# EAGLE schematic Audio-DAC (EAGLE 9.6.2)

## Sheet 1 of 2
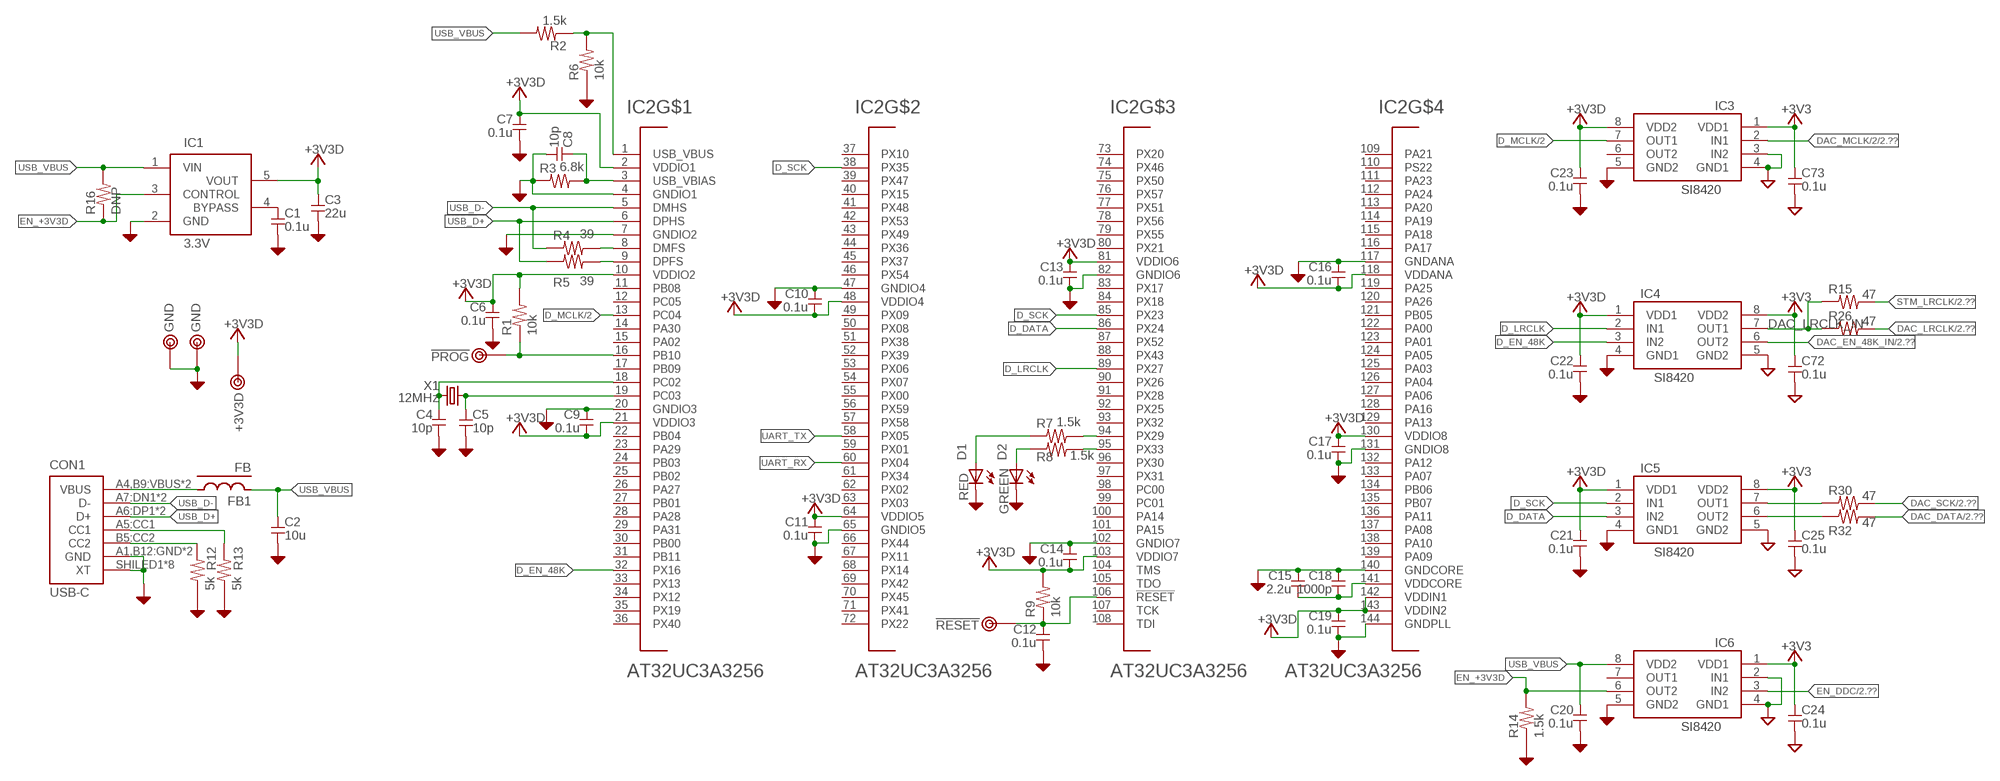
[diagram p0: schematic, sheet 1]

### Parts
C1  0.1u  C-1608  [1608C]
C2  10u  C-2012  [2012]
C3  22u  C-2012  [2012]
C4  10p  C-1608  [1608C]
C5  10p  C-1608  [1608C]
C6  0.1u  C-1608  [1608C]
C7  0.1u  C-1608  [1608C]
C8  10p  C-1608  [1608C]
C9  0.1u  C-1608  [1608C]
C10  0.1u  C-1608  [1608C]
C11  0.1u  C-1608  [1608C]
C12  0.1u  C-1608  [1608C]
C13  0.1u  C-1608  [1608C]
C14  0.1u  C-1608  [1608C]
C15  2.2u  C-2012  [2012]
C16  0.1u  C-1608  [1608C]
C17  0.1u  C-1608  [1608C]
C18  1000p  C-1608  [1608C]
C19  0.1u  C-1608  [1608C]
C20  0.1u  C-1608  [1608C]
C21  0.1u  C-1608  [1608C]
C22  0.1u  C-1608  [1608C]
C23  0.1u  C-1608  [1608C]
C24  0.1u  C-1608  [1608C]
C25  0.1u  C-1608  [1608C]
C72  0.1u  C-1608  [1608C]
C73  0.1u  C-1608  [1608C]
CON1  USB-C  [5077CR-16-SMC2-BK-TR]
D1  RED  LED-SMD1608  [D1608]
D2  GREEN  LED-SMD1608  [D1608]
FB1  FB  [1608-J]
IC1  3.3V  NJM12888  [SOT23-5]
IC2  AT32UC3A3256  [TQFP144]
IC3  SI8420  [SOP8]
IC4  SI8420  [SOP8]
IC5  SI8420  [SOP8]
IC6  SI8420  [SOP8]
R1  10k  R-1608  [1608]
R2  1.5k  R-1608  [1608]
R3  6.8k  R-1608  [1608]
R4  39  R-1608  [1608]
R5  39  R-1608  [1608]
R6  10k  R-1608  [1608]
R7  1.5k  R-1608  [1608]
R8  1.5k  R-1608  [1608]
R9  10k  R-1608  [1608]
R12  5k  R-1608  [1608]
R13  5k  R-1608  [1608]
R14  1.5k  R-1608  [1608]
R15  47  R-1608J  [1608-J]
R16  DNP  R-1608J  [1608-J]
R26  47  R-1608J  [1608-J]
R30  47  R-1608J  [1608-J]
R32  47  R-1608J  [1608-J]
TP1  !PROG  TESTPIN  [TESTPIN]
TP2  !RESET  TESTPIN  [TESTPIN]
TP3  GND  TESTPIN  [TESTPIN]
TP25  GND  TESTPIN  [TESTPIN]
TP26  +3V3D  TESTPIN  [TESTPIN]
X1  12MHz  CRYSTALHC49S  [HC49/S]

### Nets
+3V3: C24.1 C25.1 C72.1 C73.1 IC3.1(VDD1) IC4.8(VDD2) IC5.8(VDD2) IC6.1(VDD1) ; also sheet 2
+3V3D: C3.1 C6.1 C7.1 C9.2 C10.2 C11.1 C13.1 C14.2 C16.2 C17.1 C19.1 C21.1 C22.1 C23.1 IC1.5(VOUT) IC2.2(VDDIO1) IC2.10(VDDIO2) IC2.21(VDDIO3) IC2.48(VDDIO4) IC2.64(VDDIO5) IC2.81(VDDIO6) IC2.103(VDDIO7) IC2.118(VDDANA) IC2.130(VDDIO8) IC2.142(VDDIN1) IC2.143(VDDIN2) IC3.8(VDD2) IC4.1(VDD1) IC5.1(VDD1) R1.2 R9.2 TP26.1
AVR_PROG: IC2.16(PB10) R1.1 TP1.1
D_!RST: C12.1 IC2.106(!RESET) R9.1 TP2.1
D_DATA: IC2.86(PX24) IC5.3(IN2)
D_EN_48K: IC2.32(PX16) IC4.3(IN2)
D_LRCLK: IC2.89(PX27) IC4.2(IN1)
D_MCLK/2: IC2.13(PC04) IC3.7(OUT1)
D_SCK: IC2.38(PX35) IC2.85(PX23) IC5.2(IN1)
DAC_DATA: R32.2 ; also sheet 2
DAC_EN_48K_IN: IC4.6(OUT2) ; also sheet 2
DAC_LRCLK: R26.2 ; also sheet 2
DAC_LRCLK_IN: IC4.7(OUT1) R15.1 R26.1
DAC_MCLK/2: IC3.2(IN1) ; also sheet 2
DAC_SCK: R30.2 ; also sheet 2
DGND: C1.2 C2.2 C3.2 C4.2 C5.2 C6.2 C7.2 C8.2 C9.1 C10.1 C11.2 C12.2 C13.2 C14.1 C15.1 C16.1 C17.2 C18.1 C19.2 C20.2 C21.2 C22.2 C23.2 CON1.A1,B12:GND(GND) CON1.B1,A12:GND(GND) CON1.SHILED1(XT) CON1.SHILED2(XT) CON1.SHILED3(XT) CON1.SHILED4(XT) CON1.SHILED5(XT) CON1.SHILED6(XT) CON1.SHILED7(XT) CON1.SHILED8(XT) D1.K D2.K IC1.2(GND) IC2.4(GNDIO1) IC2.7(GNDIO2) IC2.20(GNDIO3) IC2.47(GNDIO4) IC2.65(GNDIO5) IC2.82(GNDIO6) IC2.102(GNDIO7) IC2.117(GNDANA) IC2.131(GNDIO8) IC2.140(GNDCORE) IC2.144(GNDPLL) IC3.5(GND2) IC4.4(GND1) IC5.4(GND1) IC6.5(GND2) R3.1 R6.1 R12.1 R13.1 R14.1 TP3.1 TP25.1
EN_+3V3D: IC1.3(CONTROL) IC6.6(OUT2) R14.2 R16.1
EN_DDC: IC6.3(IN2) ; also sheet 2
GND: C24.2 C25.2 C72.2 C73.2 IC3.3(IN2) IC3.4(GND1) IC4.5(GND2) IC5.5(GND2) IC6.2(IN1) IC6.4(GND1) ; also sheet 2
LED_GREEN: IC2.95(PX33) R8.2
LED_RED: IC2.94(PX29) R7.2
N$1: IC2.8(DMFS) R4.2
N$2: IC2.9(DPFS) R5.2
N$3: C5.1 IC2.19(PC03) X1.1
N$4: C4.1 IC2.18(PC02) X1.2
N$5: C8.1 IC2.3(USB_VBIAS) R3.2
N$6: IC2.1(USB_VBUS) R2.1 R6.2
N$7: D2.A R8.1
N$8: C15.2 C18.2 IC2.141(VDDCORE)
N$9: D1.A R7.1
N$14: IC5.7(OUT1) R30.1
N$15: C1.1 IC1.4(BYPASS)
N$17: CON1.B5:CC2(CC2) R12.2
N$18: CON1.A5:CC1(CC1) R13.2
N$32: IC5.6(OUT2) R32.1
STM_LRCLK: R15.2 ; also sheet 2
UART_RX: IC2.60(PX04)
UART_TX: IC2.58(PX05)
USB_D+: CON1.A6:DP1(D+) CON1.B6:DP2(D+) IC2.6(DPHS) R5.1
USB_D-: CON1.A7:DN1(D-) CON1.B7:DN2(D-) IC2.5(DMHS) R4.1
USB_VBUS: C2.1 C20.1 FB1.2 IC1.1(VIN) IC6.8(VDD2) R2.2 R16.2
VBUS: CON1.A4,B9:VBUS(VBUS) CON1.B4,A9:VBUS(VBUS) FB1.1
Unconnected: IC2.11(PB08) IC2.12(PC05) IC2.14(PA30) IC2.15(PA02) IC2.17(PB09) IC2.22(PB04) IC2.23(PA29) IC2.24(PB03) IC2.25(PB02) IC2.26(PA27) IC2.27(PB01) IC2.28(PA28) IC2.29(PA31) IC2.30(PB00) IC2.31(PB11) IC2.33(PX13) IC2.34(PX12) IC2.35(PX19) IC2.36(PX40) IC2.37(PX10) IC2.39(PX47) IC2.40(PX15) IC2.41(PX48) IC2.42(PX53) IC2.43(PX49) IC2.44(PX36) IC2.45(PX37) IC2.46(PX54) IC2.49(PX09) IC2.50(PX08) IC2.51(PX38) IC2.52(PX39) IC2.53(PX06) IC2.54(PX07) IC2.55(PX00) IC2.56(PX59) IC2.57(PX58) IC2.59(PX01) IC2.61(PX34) IC2.62(PX02) IC2.63(PX03) IC2.66(PX44) IC2.67(PX11) IC2.68(PX14) IC2.69(PX42) IC2.70(PX45) IC2.71(PX41) IC2.72(PX22) IC2.73(PX20) IC2.74(PX46) IC2.75(PX50) IC2.76(PX57) IC2.77(PX51) IC2.78(PX56) IC2.79(PX55) IC2.80(PX21) IC2.83(PX17) IC2.84(PX18) IC2.87(PX52) IC2.88(PX43) IC2.90(PX26) IC2.91(PX28) IC2.92(PX25) IC2.93(PX32) IC2.96(PX30) IC2.97(PX31) IC2.98(PC00) IC2.99(PC01) IC2.100(PA14) IC2.101(PA15) IC2.104(TMS) IC2.105(TDO) IC2.107(TCK) IC2.108(TDI) IC2.109(PA21) IC2.110(PS22) IC2.111(PA23) IC2.112(PA24) IC2.113(PA20) IC2.114(PA19) IC2.115(PA18) IC2.116(PA17) IC2.119(PA25) IC2.120(PA26) IC2.121(PB05) IC2.122(PA00) IC2.123(PA01) IC2.124(PA05) IC2.125(PA03) IC2.126(PA04) IC2.127(PA06) IC2.128(PA16) IC2.129(PA13) IC2.132(PA12) IC2.133(PA07) IC2.134(PB06) IC2.135(PB07) IC2.136(PA11) IC2.137(PA08) IC2.138(PA10) IC2.139(PA09) IC3.6(OUT2) IC6.7(OUT1)

## Sheet 2 of 2
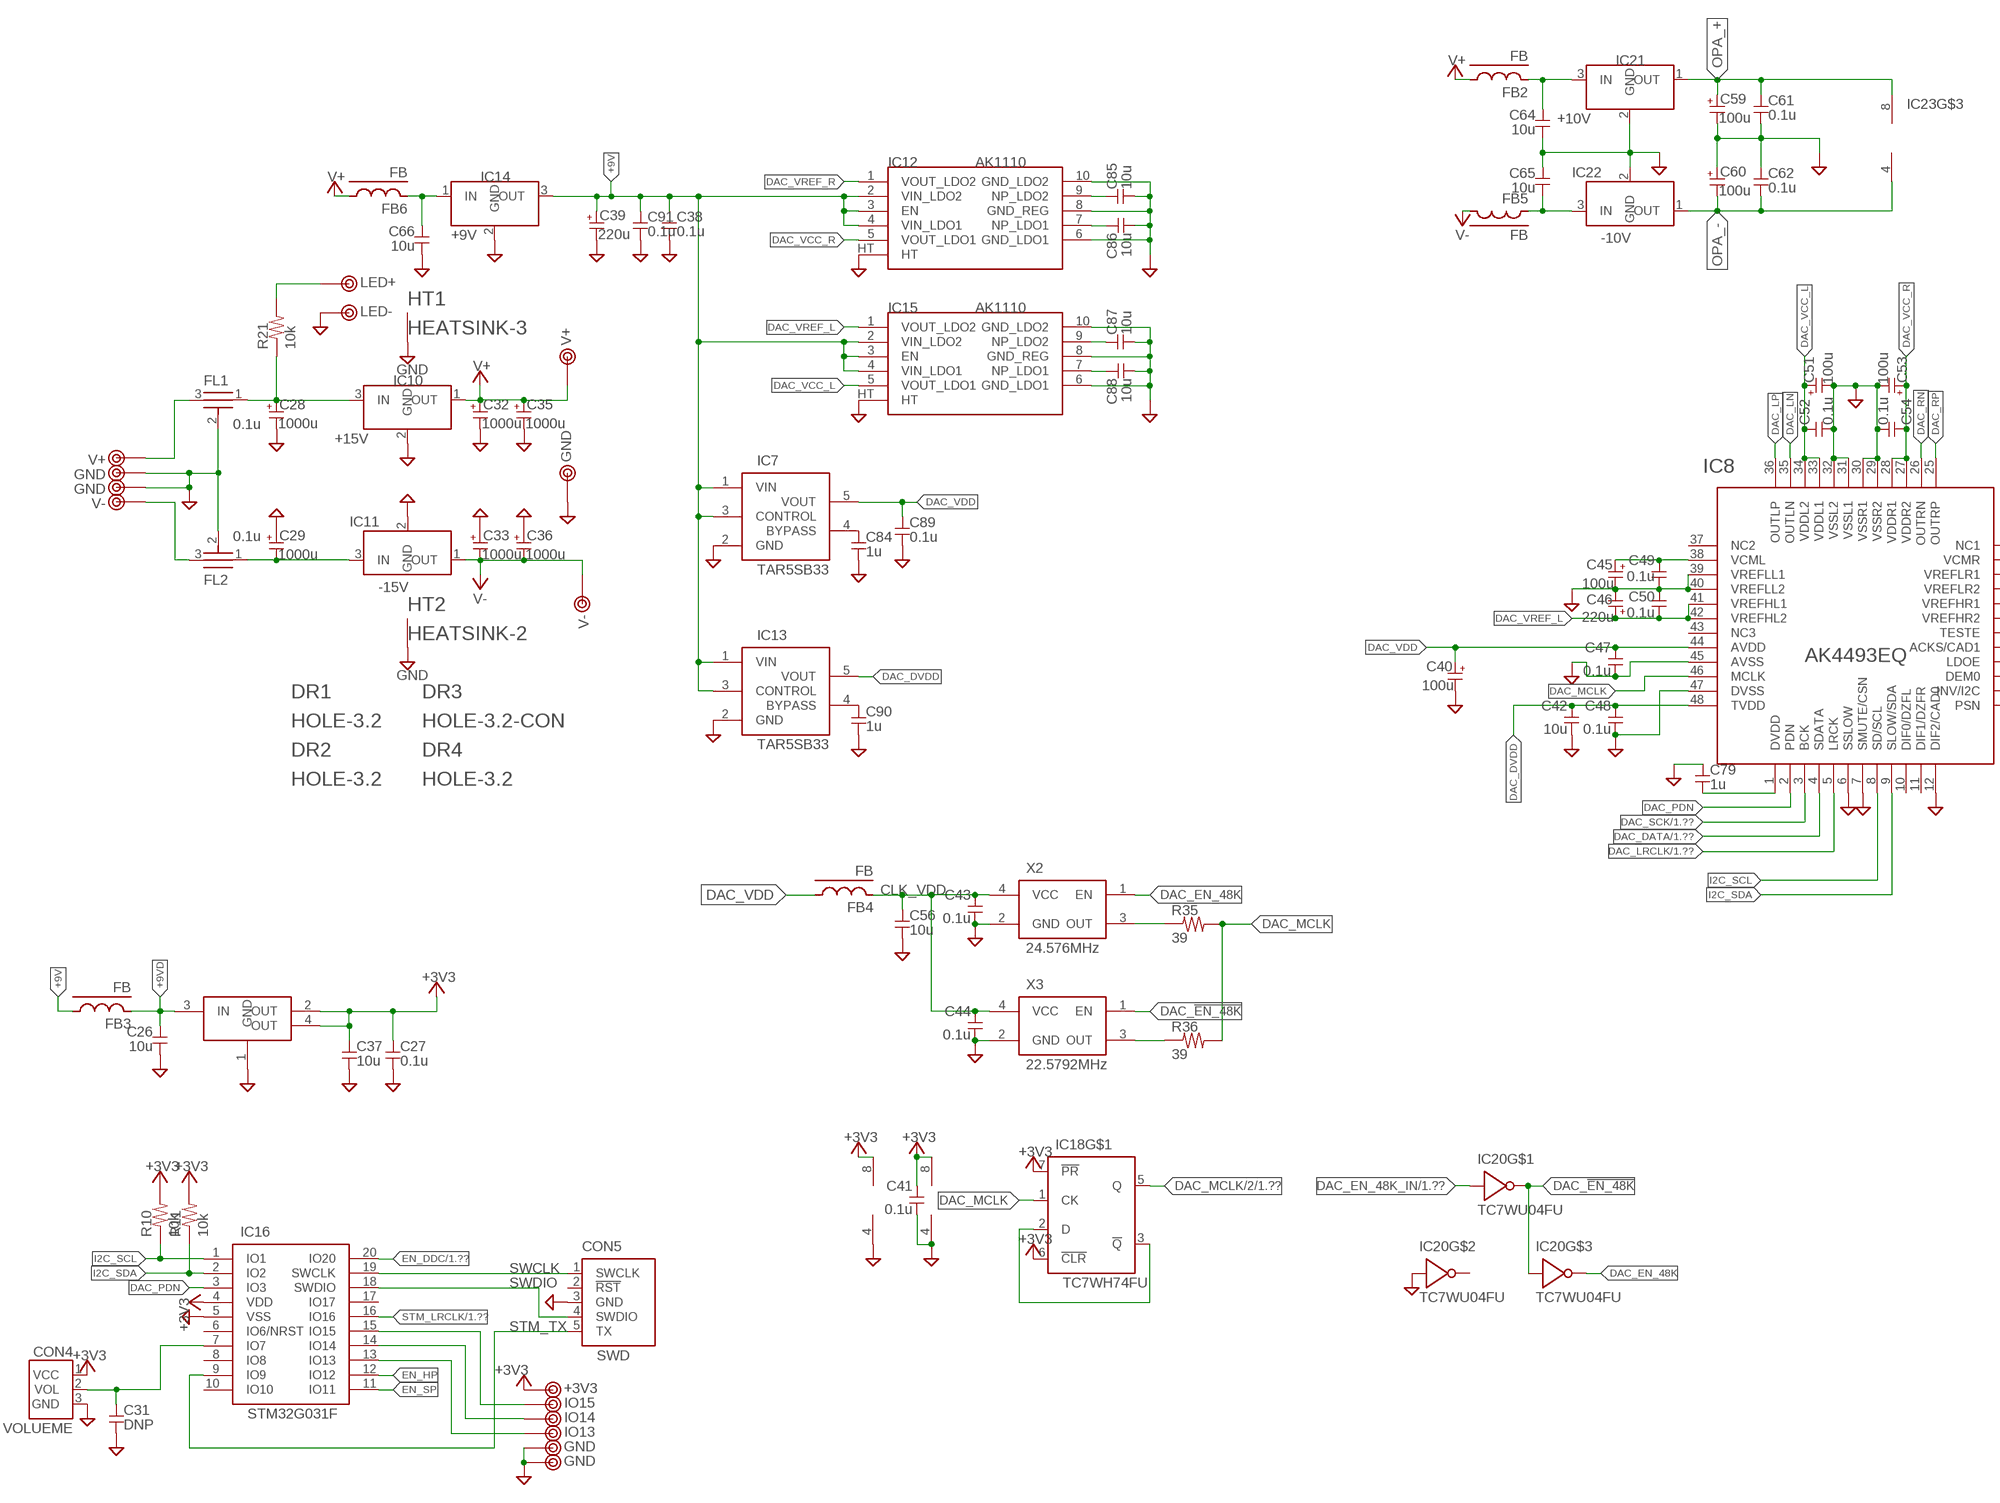
[diagram p1: schematic, sheet 2, part 1 of 2]
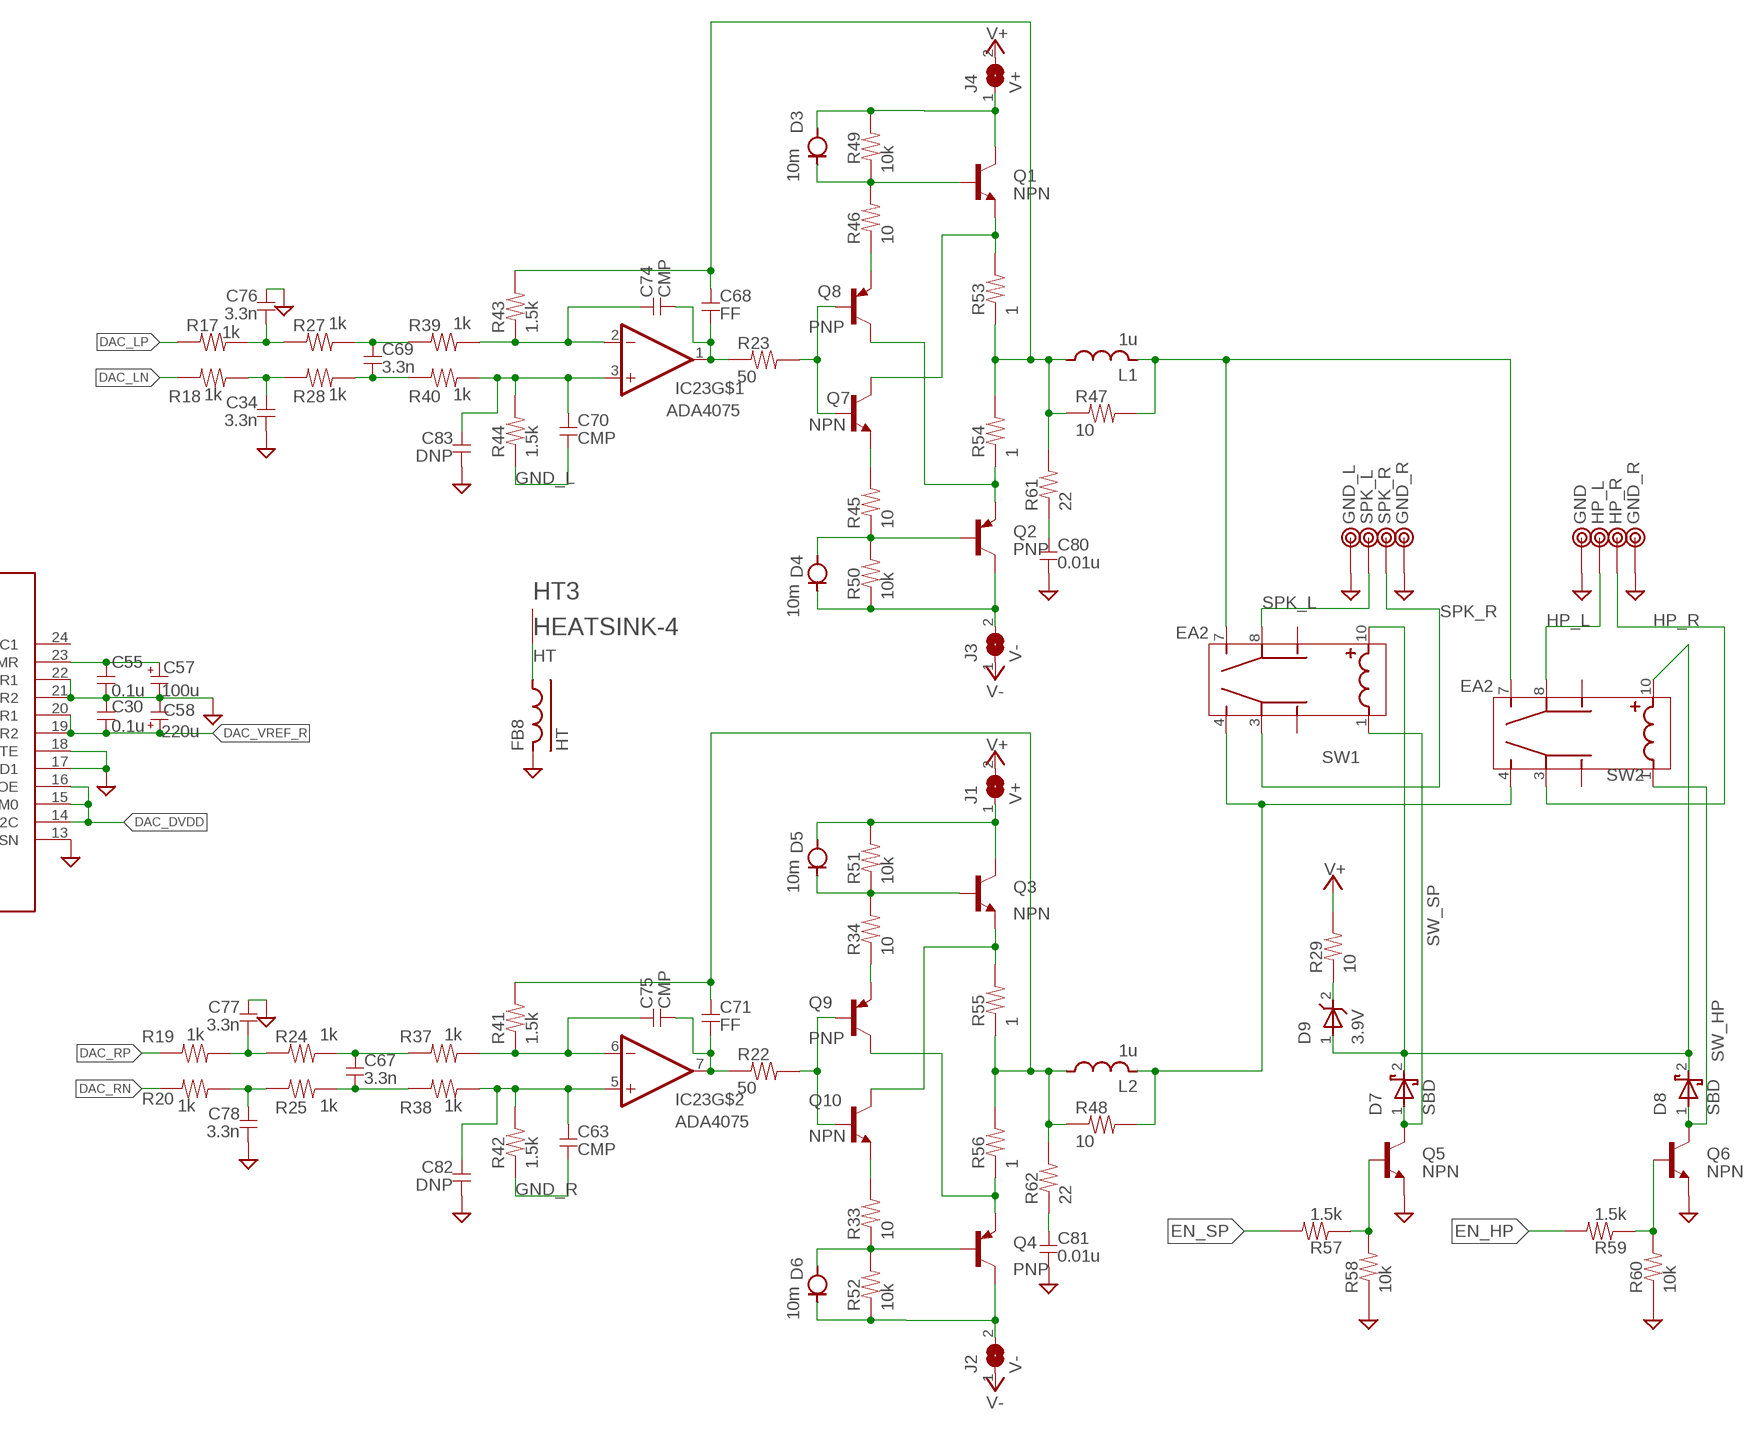
[diagram p2: schematic, sheet 2, part 2 of 2]

### Parts
C26  10u  C-2012  [2012]
C27  0.1u  C-1608  [1608C]
C28  1000u  CPOLE5-13  [E5-13]
C29  1000u  CPOLE5-13  [E5-13]
C30  0.1u  C-1608  [1608C]
C31  DNP  C-1608  [1608C]
C32  1000u  CPOLE5-10  [E5-10]
C33  1000u  CPOLE5-10  [E5-10]
C34  3.3n  C-1608  [1608C]
C35  1000u  CPOLE5-10  [E5-10]
C36  1000u  CPOLE5-10  [E5-10]
C37  10u  C-2012  [2012]
C38  0.1u  C-1608  [1608C]
C39  220u  CPOLE2.5-8  [E2,5-8]
C40  100u  CPOLE2.5-6.5  [E2.5-6.5]
C41  0.1u  C-1608  [1608C]
C42  10u  C-2012  [2012]
C43  0.1u  C-1608  [1608C]
C44  0.1u  C-1608  [1608C]
C45  100u  CPOLE2.5-6.5  [E2.5-6.5]
C46  220u  CPOLE2.5-6.5  [E2.5-6.5]
C47  0.1u  C-1608  [1608C]
C48  0.1u  C-1608  [1608C]
C49  0.1u  C-1608  [1608C]
C50  0.1u  C-1608  [1608C]
C51  100u  CPOLE2.5-6.5  [E2.5-6.5]
C52  0.1u  C-1608  [1608C]
C53  100u  CPOLE2.5-6.5  [E2.5-6.5]
C54  0.1u  C-1608  [1608C]
C55  0.1u  C-1608  [1608C]
C56  10u  C-2012  [2012]
C57  100u  CPOLE2.5-6.5  [E2.5-6.5]
C58  220u  CPOLE2.5-6.5  [E2.5-6.5]
C59  100u  CPOLE2.5-8  [E2,5-8]
C60  100u  CPOLE2.5-8  [E2,5-8]
C61  0.1u  C-1608  [1608C]
C62  0.1u  C-1608  [1608C]
C63  CMP  C-1608  [1608C]
C64  10u  C-2012  [2012]
C65  10u  C-2012  [2012]
C66  10u  C-2012  [2012]
C67  3.3n  C-1608  [1608C]
C68  FF  C-1608  [1608C]
C69  3.3n  C-1608  [1608C]
C70  CMP  C-1608  [1608C]
C71  FF  C-1608  [1608C]
C74  CMP  C-1608  [1608C]
C75  CMP  C-1608  [1608C]
C76  3.3n  C-1608  [1608C]
C77  3.3n  C-1608  [1608C]
C78  3.3n  C-1608  [1608C]
C79  1u  C-1608  [1608C]
C80  0.01u  C-2012  [2012]
C81  0.01u  C-2012  [2012]
C82  DNP  C-1608  [1608C]
C83  DNP  C-1608  [1608C]
C84  1u  C-1608  [1608C]
C85  10u  C-2012  [2012]
C86  10u  C-2012  [2012]
C87  10u  C-2012  [2012]
C88  10u  C-2012  [2012]
C89  0.1u  C-1608  [1608C]
C90  1u  C-1608  [1608C]
C91  0.1u  C-1608  [1608C]
CON4  VOLUEME  VOL_CON  [VOL_CON]
CON5  SWD  SWD_CON  [SWD_CON]
D3  10m  CRD-SMD  [SOD123]
D4  10m  CRD-SMD  [SOD123]
D5  10m  CRD-SMD  [SOD123]
D6  10m  CRD-SMD  [SOD123]
D7  SBD  SBD-1A2  [SOD123]
D8  SBD  SBD-1A2  [SOD123]
D9  3.9V  ZENER-SMD  [SOD123]
DR1  HOLE-3.2  [HOLE_3.2]
DR2  HOLE-3.2  [HOLE_3.2]
DR3  HOLE-3.2-CON  [HOLE_3.2_CON]
DR4  HOLE-3.2  [HOLE_3.2]
FB2  FB  [1608-J]
FB3  FB  [1608-J]
FB4  FB  [1608-J]
FB5  FB  [1608-J]
FB6  FB  [1608-J]
FB8  HT  FB-2012  [2012-J]
FL1  0.1u  FL  [FL1]
FL2  0.1u  FL  [FL1]
HT1  HEATSINK-3  [HEATSINK3]
HT2  HEATSINK-2  [HEATSINK2]
HT3  HEATSINK-4  [HEATSINK4]
IC7  TAR5SB33  [SOT23-5]
IC8  AK4493EQ  [LQFP48]
IC9  AZ1086H-3.3  [SOT223]
IC10  +15V  78X-LED  [REGULATOR_LED]
IC11  -15V  79X-LED  [REGULATOR_LED]
IC12  AK1110  AK1110-SMD  [PLP10-SMD]
IC13  TAR5SB33  [SOT23-5]
IC14  +9V  78X-1  [TO-220]
IC15  AK1110  AK1110-SMD  [PLP10-SMD]
IC16  STM32G031F  [TSSOP20]
IC18  TC7WH74FU  [SSOP8-P-0.65]
IC20  TC7WU04FU  [SSOP8-P-0.65]
IC21  +10V  78X-LED  [REGULATOR_LED]
IC22  -10V  79X-LED  [REGULATOR_LED]
IC23  ADA4075  OPA-2-SOP  [SOP8]
J1  V+  SJ-2012  [2012-J]
J2  V-  SJ-2012  [2012-J]
J3  V-  SJ-2012  [2012-J]
J4  V+  SJ-2012  [2012-J]
L1  1u  L-7-2  [L7-10-2]
L2  1u  L-7-2  [L7-10-2]
Q1  NPN  NPN2SC3422  [TO126]
Q2  PNP  PNP2SA1359  [TO126]
Q3  NPN  NPN2SC3422  [TO126]
Q4  PNP  PNP2SA1359  [TO126]
Q5  NPN  NPN2SC3325  [SC59]
Q6  NPN  NPN2SC3325  [SC59]
Q7  NPN  NPN2SC3325  [SC59]
Q8  PNP  PNP2SA1313  [SC59]
Q9  PNP  PNP2SA1313  [SC59]
Q10  NPN  NPN2SC3325  [SC59]
R10  10k  R-1608  [1608]
R11  10k  R-1608  [1608]
R17  1k  R-1608  [1608]
R18  1k  R-1608  [1608]
R19  1k  R-1608  [1608]
R20  1k  R-1608  [1608]
R21  10k  R-2012  [2012]
R22  50  R-1608  [1608]
R23  50  R-1608  [1608]
R24  1k  R-1608  [1608]
R25  1k  R-1608  [1608]
R27  1k  R-1608  [1608]
R28  1k  R-1608  [1608]
R29  10  R-2012  [2012]
R33  10  R-1608  [1608]
R34  10  R-1608  [1608]
R35  39  R-1608J  [1608-J]
R36  39  R-1608J  [1608-J]
R37  1k  R-1608  [1608]
R38  1k  R-1608  [1608]
R39  1k  R-1608  [1608]
R40  1k  R-1608  [1608]
R41  1.5k  R-1608  [1608]
R42  1.5k  R-1608  [1608]
R43  1.5k  R-1608  [1608]
R44  1.5k  R-1608  [1608]
R45  10  R-1608  [1608]
R46  10  R-1608  [1608]
R47  10  R-2012  [2012]
R48  10  R-2012  [2012]
R49  10k  R-1608  [1608]
R50  10k  R-1608  [1608]
R51  10k  R-1608  [1608]
R52  10k  R-1608  [1608]
R53  1  R-2.5  [0207/2V]
R54  1  R-5  [0204/5]
R55  1  R-2.5  [0207/2V]
R56  1  R-2.5  [0207/2V]
R57  1.5k  R-1608  [1608]
R58  10k  R-1608  [1608]
R59  1.5k  R-1608  [1608]
R60  10k  R-1608  [1608]
R61  22  R-2012  [2012]
R62  22  R-2012  [2012]
SW1  EA2  [EA2]
SW2  EA2  [EA2]
TP5  V+  TESTPIN-BIG  [TESTPIN-BIG]
TP6  GND  TESTPIN-BIG  [TESTPIN-BIG]
TP7  GND  TESTPIN-BIG  [TESTPIN-BIG]
TP8  V-  TESTPIN-BIG  [TESTPIN-BIG]
TP9  IO15  TESTPIN  [TESTPIN]
TP10  IO14  TESTPIN  [TESTPIN]
TP11  V+  TESTPIN-BIG  [TESTPIN-BIG]
TP12  IO13  TESTPIN  [TESTPIN]
TP13  GND  TESTPIN  [TESTPIN]
TP14  GND  TESTPIN  [TESTPIN]
TP15  LED+  TESTPIN  [TESTPIN]
TP16  LED-  TESTPIN  [TESTPIN]
TP17  +3V3  TESTPIN  [TESTPIN]
TP21  V-  TESTPIN-BIG  [TESTPIN-BIG]
TP22  GND  TESTPIN-BIG  [TESTPIN-BIG]
TP27  GND_L  TESTPIN-BIG  [TESTPIN-BIG]
TP28  SPK_L  TESTPIN-BIG  [TESTPIN-BIG]
TP29  SPK_R  TESTPIN-BIG  [TESTPIN-BIG]
TP30  GND_R  TESTPIN-BIG  [TESTPIN-BIG]
TP31  GND  TESTPIN-BIG  [TESTPIN-BIG]
TP32  HP_L  TESTPIN-BIG  [TESTPIN-BIG]
TP33  HP_R  TESTPIN-BIG  [TESTPIN-BIG]
TP34  GND_R  TESTPIN-BIG  [TESTPIN-BIG]
X2  24.576MHz  OSC-KC3225  [KC3225]
X3  22.5792MHz  OSC-KC3225  [KC3225]

### Nets
+3V3: C27.1 C37.1 C41.1 CON4.1(VCC) IC9.2(OUT) IC9.4(OUT) IC16.4(VDD) IC18.6(!CLR) IC18.7(!PR) IC18.8(V+) IC20.8(V+) R10.2 R11.2 TP17.1 ; also sheet 1
+9V: C38.1 C39.+ C91.1 FB3.1 IC7.1(VIN) IC7.3(CONTROL) IC12.2(VIN_LDO2) IC12.3(EN) IC12.4(VIN_LDO1) IC13.1(VIN) IC13.3(CONTROL) IC14.3(OUT) IC15.2(VIN_LDO2) IC15.3(EN) IC15.4(VIN_LDO1)
+9VD: C26.1 FB3.2 IC9.3(IN)
+12V: D7.2(K) D8.2(K) D9.1(A) SW1.10(L2) SW2.10(L2)
AMP_LOUT: C68.1 L1.1 R43.2 R47.1 R53.1 R54.2 R61.2
AMP_ROUT: C71.1 L2.1 R41.2 R48.1 R55.1 R56.2 R62.2
CLK_VDD: C43.1 C44.1 C56.1 FB4.2 X2.4(VCC) X3.4(VCC)
DAC_!EN_48K: IC20.3(IN) IC20.7(OUT) X3.1(EN)
DAC_DATA: IC8.4(SDATA) ; also sheet 1
DAC_DVDD: C42.1 C48.1 IC8.14(INV/I2C) IC8.15(DEM0) IC8.16(LDOE) IC8.48(TVDD) IC13.5(VOUT)
DAC_EN_48K: IC20.5(OUT) X2.1(EN)
DAC_EN_48K_IN: IC20.1(IN) ; also sheet 1
DAC_LN: IC8.35(OUTLN) R18.1
DAC_LP: IC8.36(OUTLP) R17.1
DAC_LRCLK: IC8.5(LRCK) ; also sheet 1
DAC_MCLK: IC8.46(MCLK) IC18.1(CK) R35.2 R36.2
DAC_MCLK/2: IC18.5(Q) ; also sheet 1
DAC_PDN: IC8.2(PDN) IC16.3(IO3)
DAC_RN: IC8.26(OUTRN) R20.1
DAC_RP: IC8.25(OUTRP) R19.1
DAC_SCK: IC8.3(BCK) ; also sheet 1
DAC_VCC_L: C51.+ C52.1 IC8.33(VDDL1) IC8.34(VDDL2) IC15.5(VOUT_LDO1)
DAC_VCC_R: C53.+ C54.1 IC8.27(VDDR2) IC8.28(VDDR1) IC12.5(VOUT_LDO1)
DAC_VDD: C40.+ C47.1 C89.1 FB4.1 IC7.5(VOUT) IC8.44(AVDD)
DAC_VREF_L: C46.+ C50.2 IC8.41(VREFHL1) IC8.42(VREFHL2) IC15.1(VOUT_LDO2)
DAC_VREF_R: C30.2 C58.+ IC8.19(VREFHR2) IC8.20(VREFHR1) IC12.1(VOUT_LDO2)
EN_DDC: IC16.20(IO20) ; also sheet 1
EN_HP: IC16.12(IO12) R59.2
EN_SP: IC16.11(IO11) R57.2
GND: C26.2 C27.2 C28.- C29.+ C30.1 C31.2 C32.- C33.+ C34.2 C35.- C36.+ C37.2 C38.2 C39.- C40.- C41.2 C42.2 C43.2 C44.2 C45.- C46.- C47.2 C48.2 C49.2 C50.1 C51.- C52.2 C53.- C54.2 C55.2 C56.2 C57.- C58.- C59.- C60.+ C61.2 C62.1 C64.2 C65.1 C66.2 C76.1 C77.1 C78.2 C79.1 C80.2 C81.2 C82.2 C83.2 C84.2 C85.2 C86.2 C87.2 C88.2 C89.2 C90.2 C91.2 CON4.3(GND) CON5.3(GND) FB8.2 FL1.2(GND) FL2.2(GND) HT1.HT1(HT) HT1.HT2(HT) HT2.HT1(HT) IC7.2(GND) IC8.6(SSLOW) IC8.7(SMUTE/CSN) IC8.12(DIF2/CAD0) IC8.13(PSN) IC8.17(ACKS/CAD1) IC8.18(TESTE) IC8.21(VREFLR2) IC8.22(VREFLR1) IC8.29(VSSR2) IC8.30(VSSR1) IC8.31(VSSL1) IC8.32(VSSL2) IC8.39(VREFLL1) IC8.40(VREFLL2) IC8.45(AVSS) IC8.47(DVSS) IC9.1(GND) IC10.2(GND) IC11.2(GND) IC12.6(GND_LDO1) IC12.8(GND_REG) IC12.10(GND_LDO2) IC12.HT IC13.2(GND) IC14.2(GND) IC15.6(GND_LDO1) IC15.8(GND_REG) IC15.10(GND_LDO2) IC15.HT IC16.5(VSS) IC18.4(V-) IC20.4(V-) IC20.6(IN) IC21.2(GND) IC22.2(GND) Q5.2(E) Q6.2(E) R58.1 R60.1 TP6.1 TP7.1 TP13.1 TP14.1 TP16.1 TP22.1 TP27.1 TP30.1 TP31.1 TP34.1 X2.2(GND) X3.2(GND) ; also sheet 1
GND_L: C70.2 R44.1
GND_R: C63.2 R42.1
HP_L: SW2.8(COM2) TP32.1
HP_R: SW2.3(COM1) TP33.1
HT: FB8.1 HT3.HT1(HT) HT3.HT2(HT)
I2C_SCL: IC8.8(SD/SCL) IC16.1(IO1) R10.1
I2C_SDA: IC8.9(SLOW/SDA) IC16.2(IO2) R11.1
N$10: C84.1 IC7.4(BYPASS)
N$11: C86.1 IC12.7(NP_LDO1)
N$12: C85.1 IC12.9(NP_LDO2)
N$13: C87.1 IC15.9(NP_LDO2)
N$16: D4.1(A) Q2.3(B) R45.1 R50.2
N$19: C90.1 IC13.4(BYPASS)
N$20: C64.1 FB2.2 IC21.3(IN)
N$21: C75.1 IC23.6(-IN) R37.2 R41.1
N$22: C63.1 C82.1 IC23.5(+IN) R38.2 R42.2
N$23: C65.2 FB5.2 IC22.3(IN)
N$24: C66.1 FB6.2 IC14.1(IN)
N$25: Q3.1(E) Q10.3(C) R55.2
N$26: Q9.1(B) Q10.1(B) R22.2
N$27: C69.1 R27.2 R39.1
N$28: Q4.1(E) Q9.3(C) R56.1
N$29: Q9.2(E) R34.1
N$30: Q2.1(E) Q8.3(C) R54.1
N$31: Q1.1(E) Q7.3(C) R53.2
N$33: L2.2 R48.2 SW1.4(A1) SW2.4(A1)
N$34: L1.2 R47.2 SW1.7(A2) SW2.7(A2)
N$35: Q5.1(B) R57.1 R58.2
N$36: IC16.13(IO13) TP12.1
N$37: C69.2 R28.2 R40.1
N$38: IC16.14(IO14) TP10.1
N$39: FL1.3(IN) TP5.1
N$40: FL2.3(IN) TP8.1
N$41: C77.2 R19.2 R24.1
N$42: C78.1 R20.2 R25.1
N$43: R21.2 TP15.1
N$44: C74.1 IC23.2(-IN) R39.2 R43.1
N$45: C70.1 C83.1 IC23.3(+IN) R40.2 R44.2
N$46: C79.2 IC8.1(DVDD)
N$47: C71.2 C75.2 IC23.7(OUT) R22.1
N$48: Q6.1(B) R59.1 R60.2
N$49: D3.2(K) Q1.3(B) R46.2 R49.1
N$50: C68.2 C74.2 IC23.1(OUT) R23.1
N$51: Q10.2(E) R33.2
N$52: IC16.15(IO15) TP9.1
N$53: Q7.1(B) Q8.1(B) R23.2
N$54: D6.1(A) Q4.3(B) R33.1 R52.2
N$55: D6.2(K) J2.2 Q4.2(C) R52.1
N$56: D5.2(K) Q3.3(B) R34.2 R51.1
N$57: Q7.2(E) R45.2
N$58: Q8.2(E) R46.1
N$59: C67.1 R24.2 R37.1
N$60: D5.1(A) J1.1 Q3.2(C) R51.2
N$61: D4.2(K) J3.2 Q2.2(C) R50.1
N$62: D3.1(A) J4.1 Q1.2(C) R49.2
N$63: C67.2 R25.2 R38.1
N$64: C76.2 R17.2 R27.1
N$65: C34.1 R18.2 R28.1
N$66: C80.1 R61.1
N$67: C81.1 R62.1
N$68: C88.1 IC15.7(NP_LDO1)
N$69: D9.2(C) R29.1
N$72: C31.1 CON4.2(VOL) IC16.7(IO7)
N$83: R35.1 X2.3(OUT)
N$86: R36.1 X3.3(OUT)
N$90: IC18.2(D) IC18.3(!Q)
OPA_+: C59.+ C61.1 IC21.1(OUT) IC23.8(V+)
OPA_-: C60.- C62.2 IC22.1(OUT) IC23.4(V-)
SPK_L: SW1.8(COM2) TP28.1
SPK_R: SW1.3(COM1) TP29.1
STM_LRCLK: IC16.16(IO16) ; also sheet 1
STM_TX: CON5.5(TX) IC16.9(IO9)
SW_HP: D8.1(A) Q6.3(C) SW2.1(L1)
SW_SP: D7.1(A) Q5.3(C) SW1.1(L1)
SWCLK: CON5.1(SWCLK) IC16.19(SWCLK)
SWDIO: CON5.4(SWDIO) IC16.18(SWDIO)
V+: C32.+ C35.+ FB2.1 FB6.1 IC10.1(OUT) J1.2 J4.2 R29.2 TP11.1
V-: C33.- C36.- FB5.1 IC11.1(OUT) J2.1 J3.1 TP21.1
VCOM_L: C45.+ C49.1 IC8.38(VCML)
VCOM_R: C55.1 C57.+ IC8.23(VCMR)
VIN+: C28.+ FL1.1(OUT) IC10.3(IN) R21.1
VIN-: C29.- FL2.1(OUT) IC11.3(IN)
Unconnected: CON5.2(!RST) IC8.10(DIF0/DZFL) IC8.11(DIF1/DZFR) IC8.24(NC1) IC8.37(NC2) IC8.43(NC3) IC16.6(IO6/NRST) IC16.8(IO8) IC16.10(IO10) IC16.17(IO17) IC20.2(OUT) SW1.2(B1) SW1.9(B2) SW2.2(B1) SW2.9(B2)

## Library data of the parts
C1-C27 C30 C31 C34 C37 C38 C41-C44 C47-C50 C52 C54-C56 C61-C91 = my_rcl:C
C28 C29 C32 C33 C35 C36 C39 C40 C45 C46 C51 C53 C57-C60 = my_rcl:CPOL
CON1 = my_connector:USB-C
CON4 = my_connector:VOL_CON
CON5 = my_connector:SWD_CON
D1 D2 = my_rcl:LED
D3-D6 = my_rcl:CRD
D7 D8 = my_rcl:SBD
D9 = my_rcl:ZENER
DR1-DR4 = my_connector:HOLE-3.2
FB1-FB6 FB8 = my_rcl:FB
FL1 FL2 = my_rcl:FL
HT1-HT3 = my_connector:HEATSINK
IC1 = my_ic:NJM12888
IC2 = my_ic:AT32UC3A3256
IC3-IC6 = my_ic:SI8420
IC7 IC13 = my_ic:TAR5SB33
IC8 = my_ic:AK4493EQ
IC9 = my_ic:AZ1086?-*
IC10 IC14 IC21 = my_ic:78X
IC11 IC22 = my_ic:79X
IC12 IC15 = my_ic:AK1110
IC16 = my_ic:STM32G031F
IC18 = my_ic:TC7WH74FU
IC20 = my_ic:TC7WU04FU
IC23 = my_ic:OPA-2
J1-J4 = my_rcl:SJ
L1 L2 = my_rcl:L
Q1 Q3 Q5-Q7 Q10 = my_ic:NPN
Q2 Q4 Q8 Q9 = my_ic:PNP
R1-R30 R32-R62 = my_rcl:R
SW1 SW2 = my_rcl:EA2
TP1-TP3 TP5-TP17 TP21 TP22 TP25-TP34 = my_connector:TESTPIN
X1 = my_rcl:CRYSTAL: CRYSTAL
X2 X3 = my_rcl:OSC